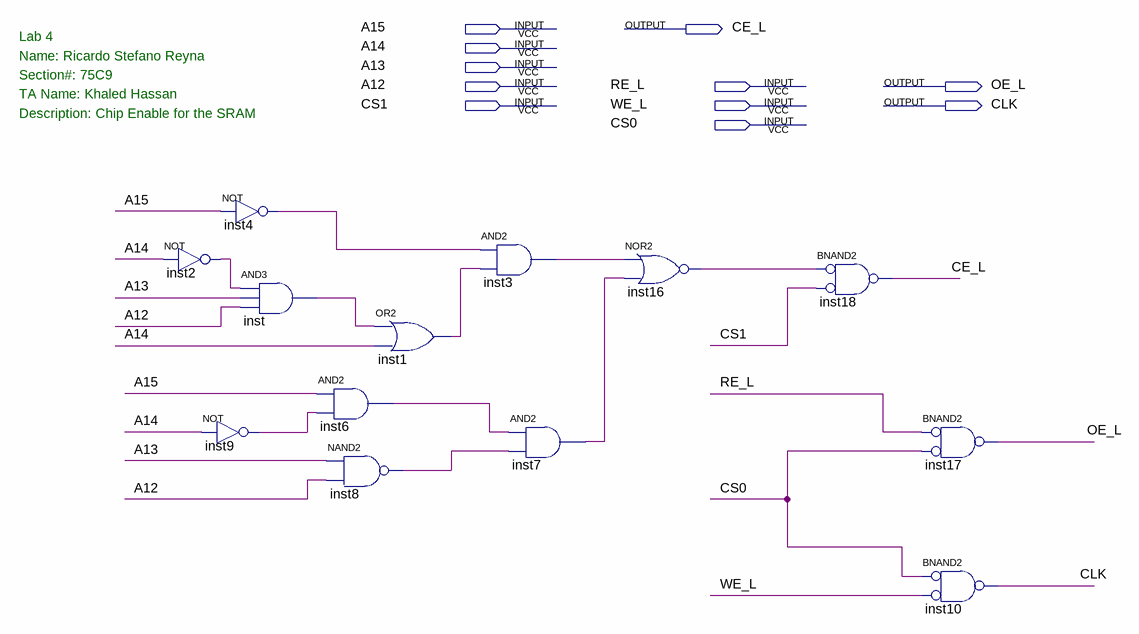
[diagram p0: schematic sheet]
// Quartus schematic Lab4_B_RSR.bdf as structural Verilog: 13 symbols, 11 pins
module Lab4_B_RSR (
  input  A15,
  input  A14,
  input  A13,
  input  A12,
  input  RE_L,
  input  CS1,
  input  WE_L,
  input  CS0,
  output CE_L,
  output OE_L,
  output CLK
);

  wire inst1_out, inst2_out, inst3_out, inst4_out, inst6_out, inst7_out, inst8_out, inst9_out, inst16_out,
       inst_out;

  not inst2 (inst2_out, A14);
  not inst4 (inst4_out, A15);
  and inst (inst_out, inst2_out, A13, A12);
  not inst9 (inst9_out, A14);
  and inst6 (inst6_out, A15, inst9_out);
  nand inst8 (inst8_out, A13, A12);
  or inst1 (inst1_out, inst_out, A14);
  and inst3 (inst3_out, inst4_out, inst1_out);
  and inst7 (inst7_out, inst6_out, inst8_out);
  nor inst16 (inst16_out, inst3_out, inst7_out);
  nand inst18 (CE_L, ~inst16_out, ~CS1);  // BNAND2
  nand inst17 (OE_L, ~RE_L, ~CS0);  // BNAND2
  nand inst10 (CLK, ~CS0, ~WE_L);  // BNAND2

  // Notes on the sheet:
  //   Lab 4
  //   Name: Ricardo Stefano Reyna
  //   Section#: 75C9
  //   TA Name: Khaled Hassan
  //   Description: Chip Enable for the SRAM
endmodule
